# Altium schematic sheet EduSAT-EPSv2.SchDoc
size A; DocumentNumber: 1; SheetNumber: 1; SheetTotal: 7
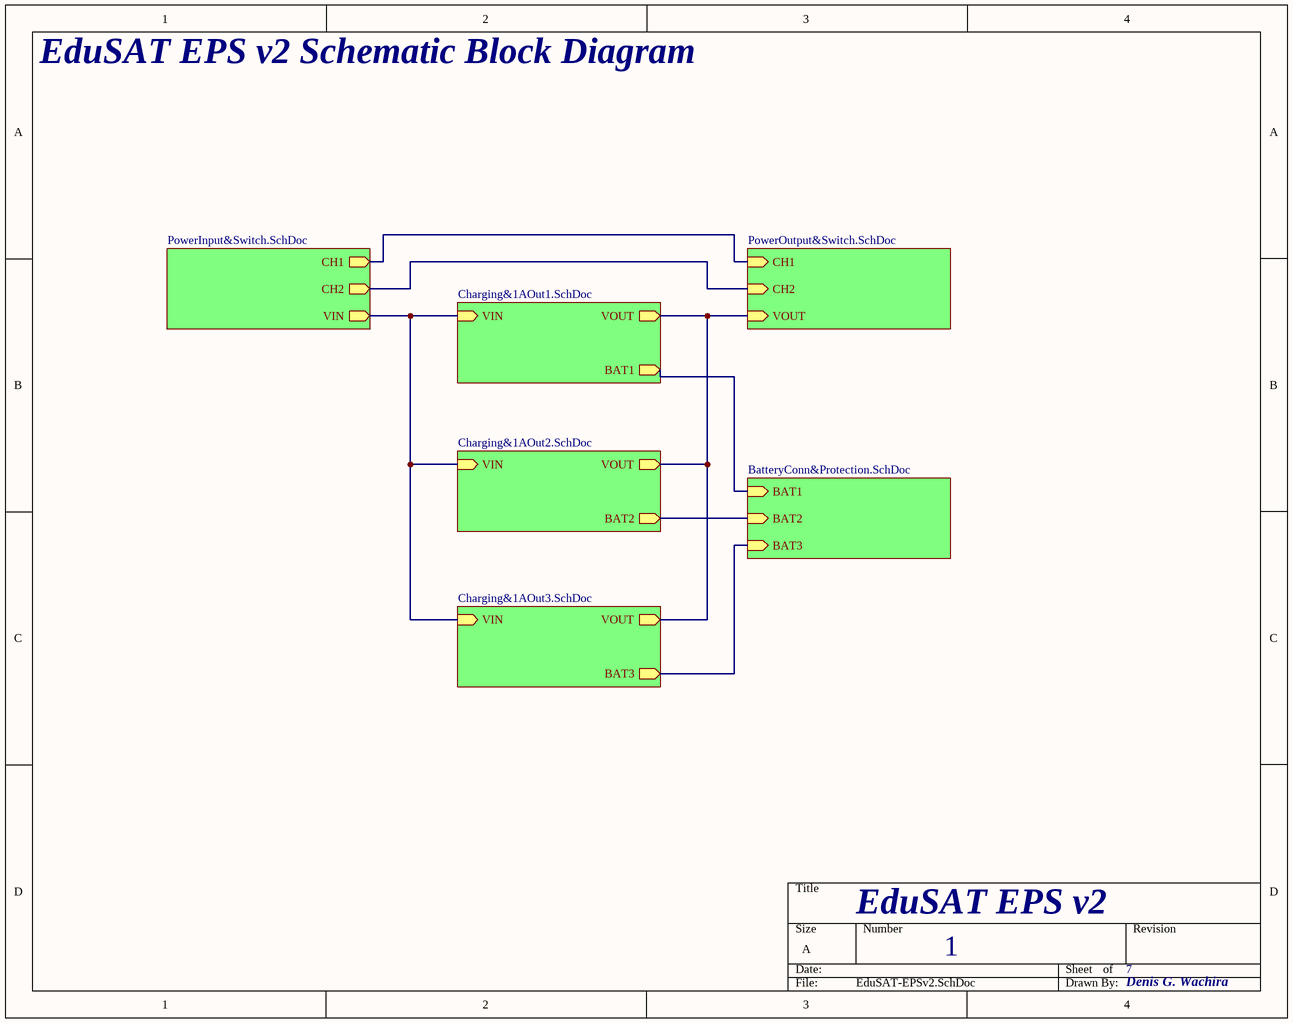
[diagram p0: EduSAT-EPSv2.SchDoc]

## Sub-sheets
U_BatteryConn&Protection = BatteryConn&Protection.SchDoc: BAT1 (in), BAT2 (in), BAT3 (in)
U_Charging&1AOut1 = Charging&1AOut1.SchDoc: VOUT (out), VIN (in), BAT1 (out)
U_Charging&1AOut2 = Charging&1AOut2.SchDoc: VOUT (out), VIN (in), BAT2 (out)
U_Charging&1AOut3 = Charging&1AOut3.SchDoc: VOUT (out), VIN (in), BAT3 (out)
U_PowerInput&Switch = PowerInput&Switch.SchDoc: CH1 (out), VIN (out), CH2 (out)
U_PowerOutput&Switch = PowerOutput&Switch.SchDoc: VOUT (in), CH1 (in), CH2 (in)

## Nets
(unnamed): sheet U_BatteryConn&Protection/BAT1, sheet U_Charging&1AOut1/BAT1
(unnamed): sheet U_BatteryConn&Protection/BAT2, sheet U_Charging&1AOut2/BAT2
(unnamed): sheet U_BatteryConn&Protection/BAT3, sheet U_Charging&1AOut3/BAT3
(unnamed): sheet U_Charging&1AOut1/VOUT, sheet U_Charging&1AOut2/VOUT, sheet U_Charging&1AOut3/VOUT, sheet U_PowerOutput&Switch/VOUT
(unnamed): sheet U_Charging&1AOut1/VIN, sheet U_PowerInput&Switch/VIN, sheet U_Charging&1AOut2/VIN, sheet U_Charging&1AOut3/VIN
(unnamed): sheet U_PowerInput&Switch/CH1, sheet U_PowerOutput&Switch/CH1
(unnamed): sheet U_PowerInput&Switch/CH2, sheet U_PowerOutput&Switch/CH2

## Notes on the sheet
- EduSAT EPS v2 Schematic Block Diagram
- EduSAT EPS v2
- Denis G. Wachira